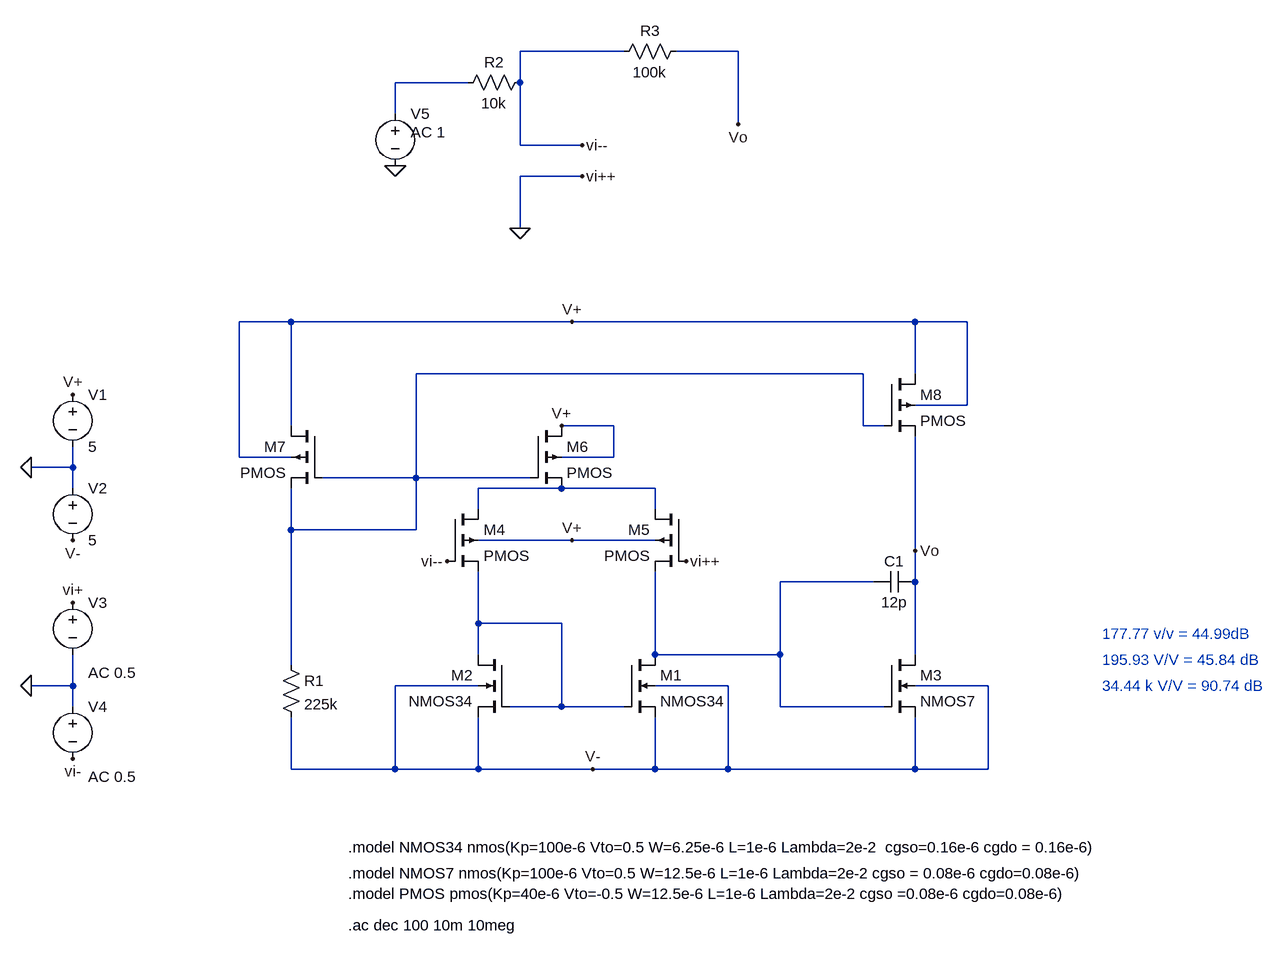
[diagram p0: schematic Q1.asc]
Q1.asc, the LTspice schematic file:
Version 4
SHEET 1 1712 680
WIRE 224 -800 64 -800
WIRE 400 -800 304 -800
WIRE -16 -752 -128 -752
WIRE 64 -752 64 -800
WIRE -128 -704 -128 -752
WIRE 400 -688 400 -800
WIRE 64 -656 64 -752
WIRE 160 -656 64 -656
WIRE 160 -608 64 -608
WIRE 64 -528 64 -608
WIRE -288 -384 -368 -384
WIRE 144 -384 -288 -384
WIRE 672 -384 144 -384
WIRE 752 -384 672 -384
WIRE 592 -304 -96 -304
WIRE 672 -304 672 -384
WIRE 752 -256 752 -384
WIRE 752 -256 672 -256
WIRE -288 -224 -288 -384
WIRE 208 -224 128 -224
WIRE 592 -224 592 -304
WIRE 624 -224 592 -224
WIRE -368 -176 -368 -384
WIRE -288 -176 -368 -176
WIRE 208 -176 208 -224
WIRE 208 -176 128 -176
WIRE -624 -160 -624 -192
WIRE -624 -160 -688 -160
WIRE -96 -144 -96 -304
WIRE -96 -144 -240 -144
WIRE 80 -144 -96 -144
WIRE -624 -128 -624 -160
WIRE 128 -128 0 -128
WIRE 272 -128 128 -128
WIRE 0 -96 0 -128
WIRE 272 -96 272 -128
WIRE -288 -64 -288 -128
WIRE -96 -64 -96 -144
WIRE -96 -64 -288 -64
WIRE 144 -48 0 -48
WIRE 272 -48 144 -48
WIRE 672 -32 672 -208
WIRE 608 16 464 16
WIRE 672 16 672 -32
WIRE 0 80 0 0
WIRE 128 80 0 80
WIRE 0 128 0 80
WIRE 272 128 272 0
WIRE 464 128 464 16
WIRE 464 128 272 128
WIRE 672 128 672 16
WIRE -288 144 -288 -64
WIRE -624 176 -624 128
WIRE -624 176 -688 176
WIRE 0 176 -128 176
WIRE 384 176 272 176
WIRE 784 176 672 176
WIRE -624 208 -624 176
WIRE 128 208 128 80
WIRE 128 208 48 208
WIRE 224 208 128 208
WIRE 464 208 464 128
WIRE 624 208 464 208
WIRE -288 304 -288 224
WIRE -128 304 -128 176
WIRE -128 304 -288 304
WIRE 0 304 0 224
WIRE 0 304 -128 304
WIRE 176 304 0 304
WIRE 272 304 272 224
WIRE 272 304 176 304
WIRE 384 304 384 176
WIRE 384 304 272 304
WIRE 672 304 672 224
WIRE 672 304 384 304
WIRE 784 304 784 176
WIRE 784 304 672 304
FLAG -688 -160 0
FLAG 176 304 V-
FLAG 128 -224 V+
FLAG 144 -384 V+
FLAG -48 -16 vi--
FLAG 320 -16 vi++
FLAG -688 176 0
FLAG 144 -48 V+
FLAG -128 -624 0
FLAG 672 -32 Vo
FLAG 400 -688 Vo
FLAG 64 -528 0
FLAG 160 -656 vi--
FLAG 160 -608 vi++
FLAG -624 -272 V+
FLAG -624 -48 V-
FLAG -624 288 vi-
FLAG -624 48 vi+
SYMBOL nmos4 224 128 R0
SYMATTR InstName M1
SYMATTR Value NMOS34
SYMBOL nmos4 48 128 M0
SYMATTR InstName M2
SYMATTR Value NMOS34
SYMBOL nmos4 624 128 R0
SYMATTR InstName M3
SYMATTR Value NMOS7
SYMBOL cap 672 0 R90
WINDOW 0 0 32 VBottom 2
WINDOW 3 32 32 VTop 2
SYMATTR InstName C1
SYMATTR Value 12p
SYMBOL pmos4 -48 -96 R0
SYMATTR InstName M4
SYMBOL pmos4 320 -96 M0
SYMATTR InstName M5
SYMBOL pmos4 80 -224 R0
SYMATTR InstName M6
SYMBOL pmos4 -240 -224 M0
SYMATTR InstName M7
SYMBOL pmos4 624 -304 R0
SYMATTR InstName M8
SYMBOL res -304 128 R0
SYMATTR InstName R1
SYMATTR Value 225k
SYMBOL voltage -624 -288 R0
WINDOW 123 0 0 Left 0
WINDOW 39 0 0 Left 0
SYMATTR InstName V1
SYMATTR Value 5
SYMBOL voltage -624 -144 R0
WINDOW 123 0 0 Left 0
WINDOW 39 0 0 Left 0
SYMATTR InstName V2
SYMATTR Value 5
SYMBOL voltage -624 32 R0
WINDOW 3 24 152 Invisible 2
WINDOW 123 24 124 Left 2
WINDOW 39 0 0 Left 0
SYMATTR Value SINE(0 10m 1k)
SYMATTR Value2 AC 0.5
SYMATTR InstName V3
SYMBOL voltage -624 192 R0
WINDOW 3 24 96 Invisible 2
WINDOW 123 24 124 Left 2
WINDOW 39 0 0 Left 0
SYMATTR Value SINE(0 10m 1k)
SYMATTR Value2 AC 0.5
SYMATTR InstName V4
SYMBOL voltage -128 -720 R0
WINDOW 123 24 44 Left 2
WINDOW 39 0 0 Left 0
SYMATTR Value2 AC 1
SYMATTR InstName V5
SYMATTR Value ""
SYMBOL res 80 -768 R90
WINDOW 0 0 56 VBottom 2
WINDOW 3 32 56 VTop 2
SYMATTR InstName R2
SYMATTR Value 10k
SYMBOL res 320 -816 R90
WINDOW 0 0 56 VBottom 2
WINDOW 3 32 56 VTop 2
SYMATTR InstName R3
SYMATTR Value 100k
TEXT -200 424 Left 2 !.model NMOS34 nmos(Kp=100e-6 Vto=0.5 W=6.25e-6 L=1e-6 Lambda=2e-2  cgso=0.16e-6 cgdo = 0.16e-6)
TEXT -200 464 Left 2 !.model NMOS7 nmos(Kp=100e-6 Vto=0.5 W=12.5e-6 L=1e-6 Lambda=2e-2 cgso = 0.08e-6 cgdo=0.08e-6)
TEXT -200 496 Left 2 !.model PMOS pmos(Kp=40e-6 Vto=-0.5 W=12.5e-6 L=1e-6 Lambda=2e-2 cgso =0.08e-6 cgdo=0.08e-6)
TEXT -200 544 Left 2 !.ac dec 100 10m 10meg
TEXT 960 96 Left 2 ;177.77 v/v = 44.99dB
TEXT 960 136 Left 2 ;195.93 V/V = 45.84 dB
TEXT 960 176 Left 2 ;34.44 k V/V = 90.74 dB

The netlist it stands for:
* Q1.asc
M1 N004 N005 V- V- NMOS34
M2 N005 N005 V- V- NMOS34
M3 Vo N004 V- V- NMOS7
C1 Vo N004 12p
M4 N003 vi-- N005 V+ PMOS
M5 N003 0 N004 V+ PMOS
M6 V+ N002 N003 V+ PMOS
M7 V+ N002 N002 V+ PMOS
M8 V+ N002 Vo V+ PMOS
R1 N002 V- 225k
V1 V+ 0 5
V2 0 V- 5
V3 vi+ 0 SINE(0 10m 1k) AC 0.5
V4 0 vi- SINE(0 10m 1k) AC 0.5
V5 N001 0 AC 1
R2 vi-- N001 10k
R3 Vo vi-- 100k
.model NMOS NMOS
.model PMOS PMOS
.lib standard.mos
.model NMOS34 nmos(Kp=100e-6 Vto=0.5 W=6.25e-6 L=1e-6 Lambda=2e-2  cgso=0.16e-6 cgdo = 0.16e-6)
.model NMOS7 nmos(Kp=100e-6 Vto=0.5 W=12.5e-6 L=1e-6 Lambda=2e-2 cgso = 0.08e-6 cgdo=0.08e-6)
.model PMOS pmos(Kp=40e-6 Vto=-0.5 W=12.5e-6 L=1e-6 Lambda=2e-2 cgso =0.08e-6 cgdo=0.08e-6)
.ac dec 100 10m 10meg
* 177.77 v/v = 44.99dB
* 195.93 V/V = 45.84 dB
* 34.44 k V/V = 90.74 dB
.backanno
.end